# Altium project date_monocolour.PrjPcb
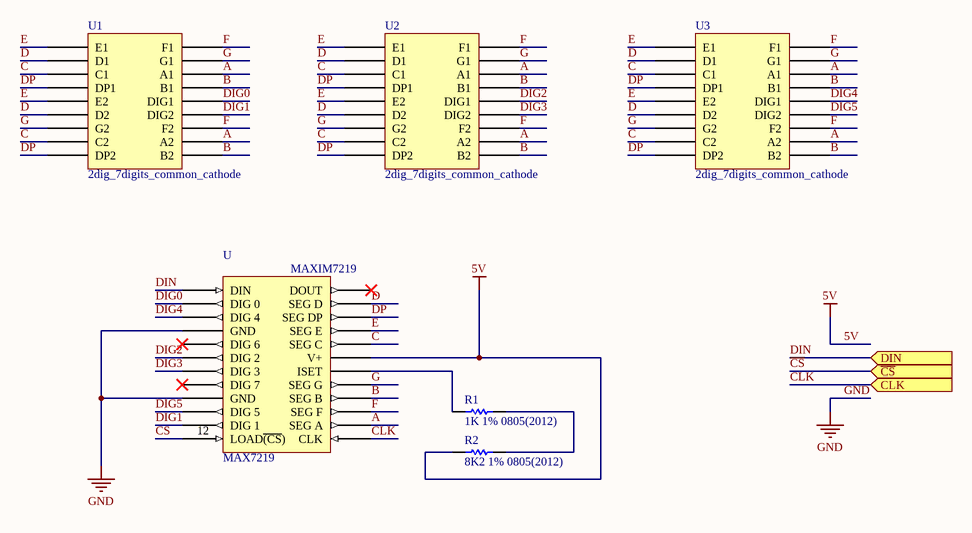
[diagram p0: date_monocolour.SchDoc]
1 sheet, 6 parts. Net scope: flat (ports and power ports of the same name join across sheets).
Board file: date_monocolour.PcbDoc

## Sheet date_monocolour.SchDoc
size A4

### Parts
R1  1K 1% 0805(2012)  [RESC0805(2012)_M]
R2  8K2 1% 0805(2012)  [RESC0805(2012)_M]
U  MAX7219  [DIP24]
U1  2dig_7digits_common_cathode  [HDSP-52]
U2  2dig_7digits_common_cathode  [HDSP-52]
U3  2dig_7digits_common_cathode  [HDSP-52]

### Ports
CLK (in), DIN (in), ~{CS} (in)

### Nets
5V: R2.1 U.19(V+)
GND: U.4(GND) U.9(GND)
~{CS}: U.12(LOAD~{(CS})) ; port ~{CS}
A: U.14(SEG_A) U1.11(A2) U1.16(A1) U2.11(A2) U2.16(A1) U3.11(A2) U3.16(A1)
B: U.16(SEG_B) U1.10(B2) U1.15(B1) U2.10(B2) U2.15(B1) U3.10(B2) U3.15(B1)
C: U.20(SEG_C) U1.3(C1) U1.8(C2) U2.3(C1) U2.8(C2) U3.3(C1) U3.8(C2)
CLK: U.13(CLK) ; port CLK
D: U.23(SEG_D) U1.2(D1) U1.6(D2) U2.2(D1) U2.6(D2) U3.2(D1) U3.6(D2)
DIG0: U.2(DIG_0) U1.14(DIG1)
DIG1: U.11(DIG_1) U1.13(DIG2)
DIG2: U.6(DIG_2) U2.14(DIG1)
DIG3: U.7(DIG_3) U2.13(DIG2)
DIG4: U.3(DIG_4) U3.14(DIG1)
DIG5: U.10(DIG_5) U3.13(DIG2)
DIN: U.1(DIN) ; port DIN
DP: U.22(SEG_DP) U1.4(DP1) U1.9(DP2) U2.4(DP1) U2.9(DP2) U3.4(DP1) U3.9(DP2)
E: U.21(SEG_E) U1.1(E1) U1.5(E2) U2.1(E1) U2.5(E2) U3.1(E1) U3.5(E2)
F: U.15(SEG_F) U1.12(F2) U1.18(F1) U2.12(F2) U2.18(F1) U3.12(F2) U3.18(F1)
G: U.17(SEG_G) U1.7(G2) U1.17(G1) U2.7(G2) U2.17(G1) U3.7(G2) U3.17(G1)
NetR1_1: R1.1 U.18(ISET)
NetR1_2: R1.2 R2.2

Not connected (* = marked no-connect by the designer): U 5(DIG_6)* 8(DIG_7)* 24(DOUT)*

### Notes on the sheet
- Title
- Size:
- Date:
- A4
- Number:
- Time:
- Revision:
- Sheet
- of
- File:
- (in symbol MAX7219) MAXIM7219

### Library data of the parts
R1 R2 = CMP-1013-00954-1: 8M45 0.125W 1% 0805 (2012 Metric)  SMD; Case-EIA: 0805; Case-Metric: 2012; Value: 8450000.00 Ohm; Technology: SMT; Power: 0.125 W; Tolerance: 1 %
U = MAX7219: Serial Interface, 8-Digit LED Display Drivers
U1-U3 = HDSP-52: 2 digits 7 bits display Green 14.2mm